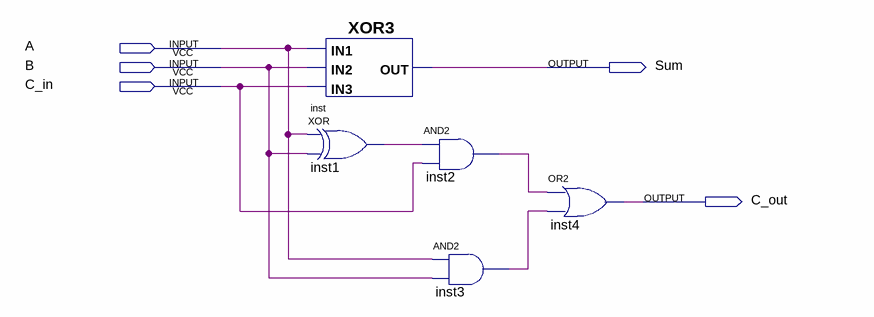
[diagram p0: schematic sheet]
// Quartus schematic LAB3_Fulladder1bit.bdf as structural Verilog: 5 symbols, 5 pins
module LAB3_Fulladder1bit (
  input  A,
  input  B,
  input  C_in,
  output Sum,
  output C_out
);

  wire inst1_out, inst2_out, inst3_out;

  XOR3 inst (.IN3(C_in), .IN1(A), .IN2(B), .OUT(Sum));
  xor inst1 (inst1_out, A, B);
  and inst2 (inst2_out, inst1_out, C_in);
  and inst3 (inst3_out, A, B);
  or inst4 (C_out, inst2_out, inst3_out);
endmodule
